# Altium schematic sheet K10P100最小系统V1.0.SchDoc
size A3
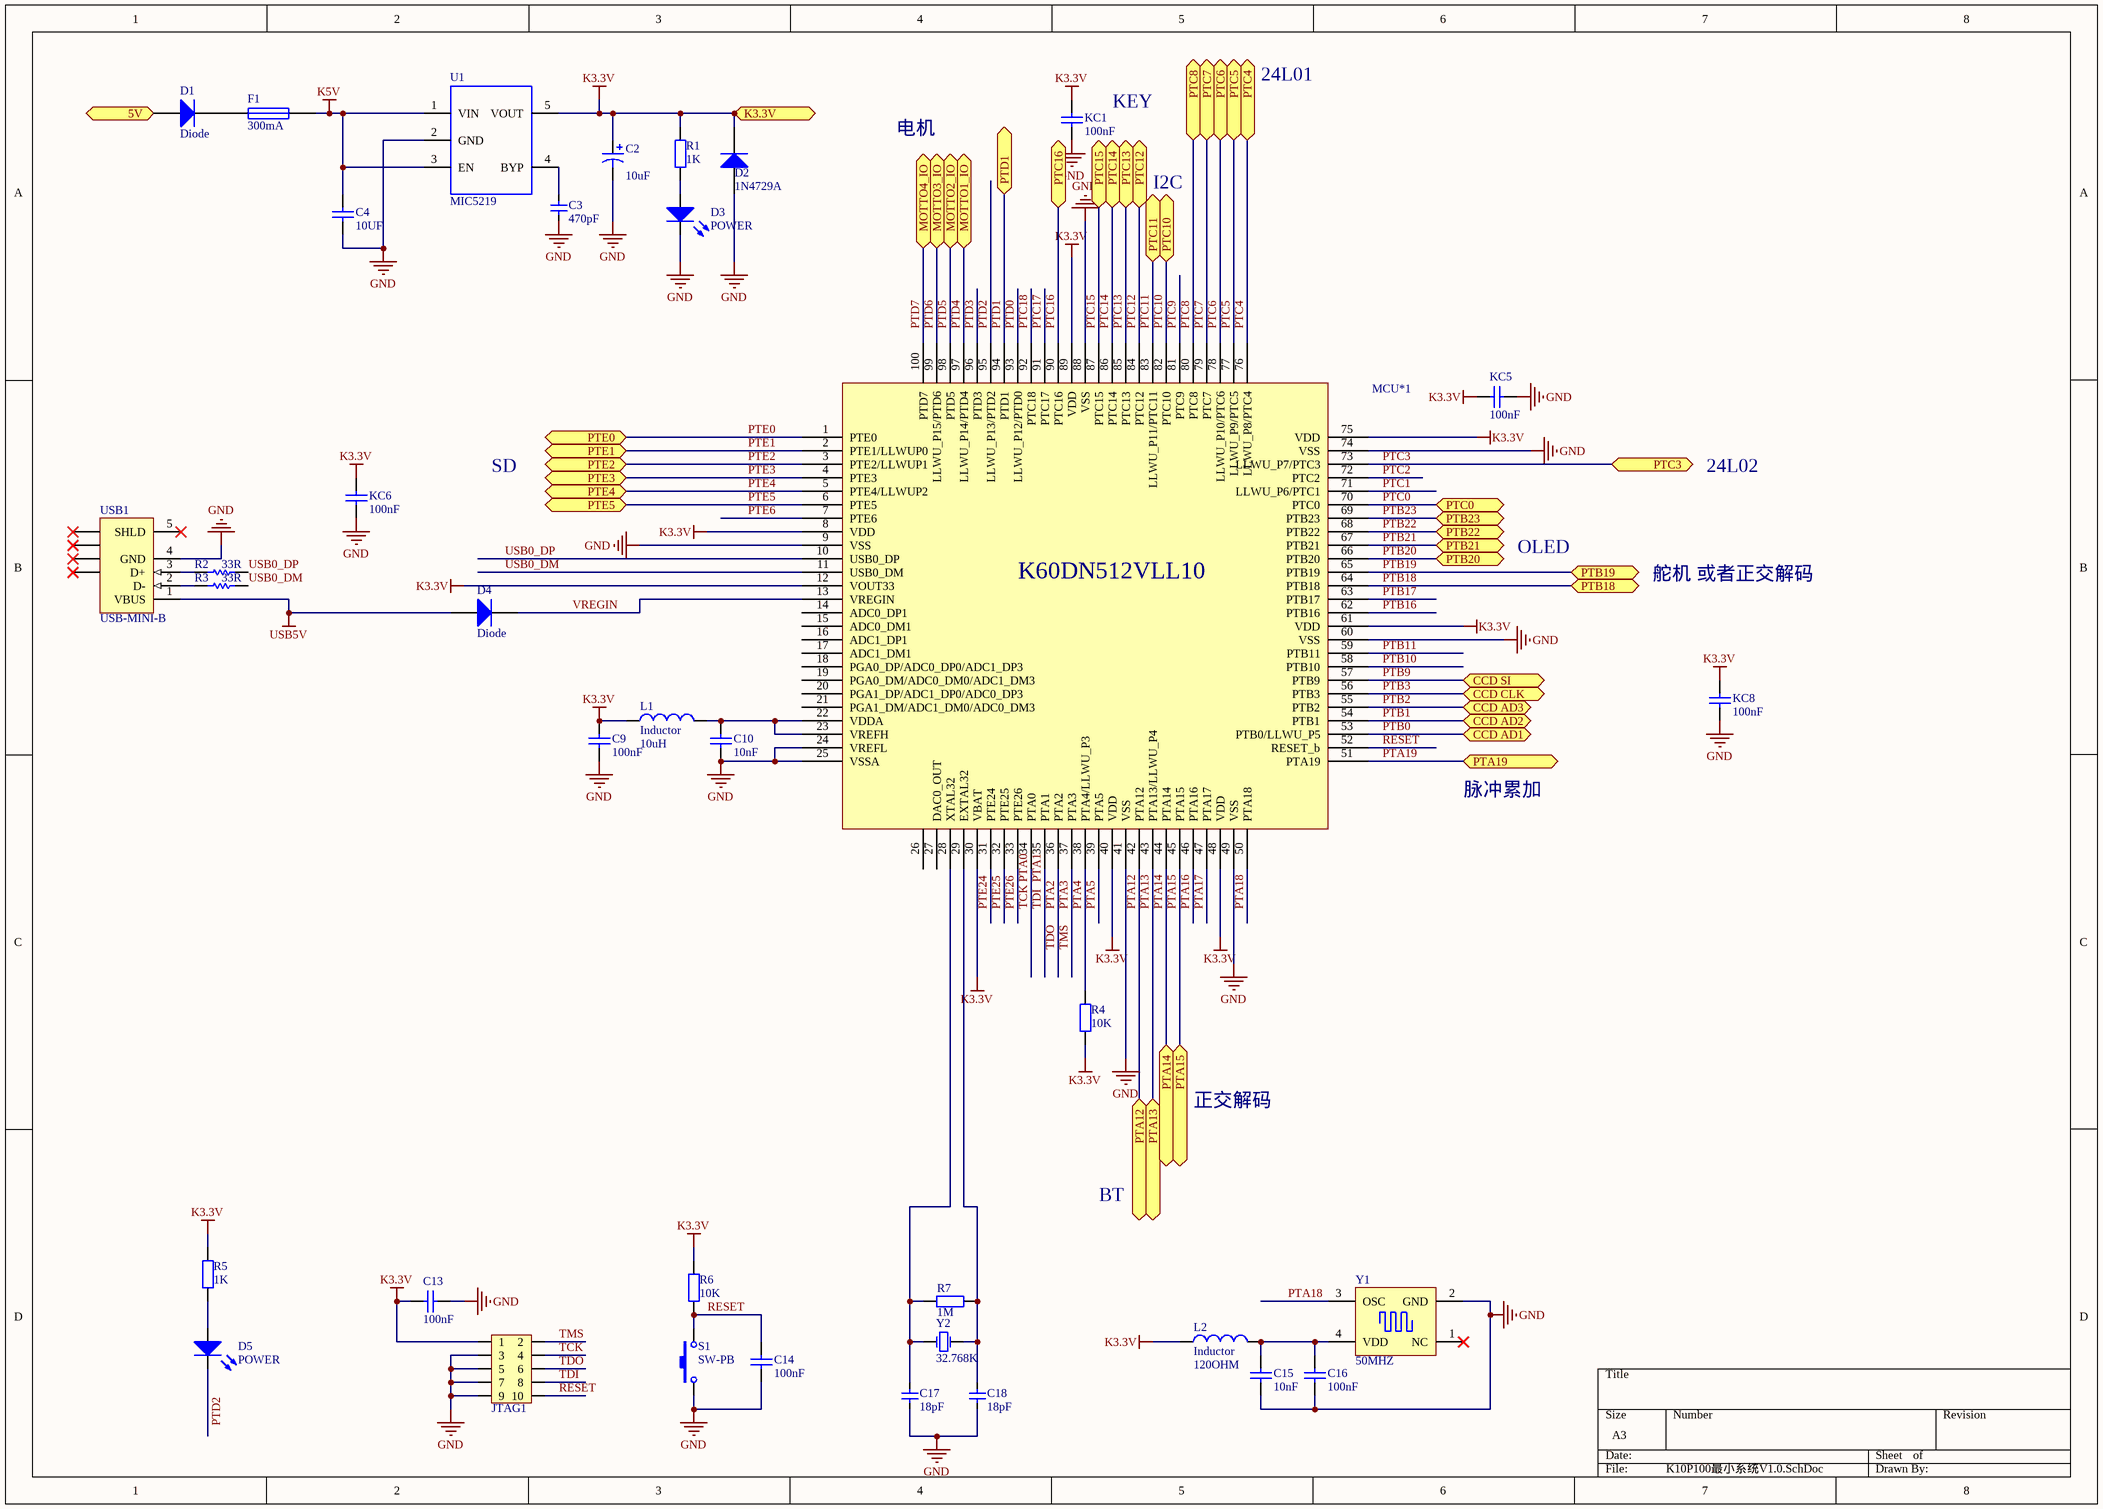
[diagram p0: K10P100最小系统V1.0.SchDoc]

## Parts
C2  value 10uF  [C2012]  (hidden comment: Cap Pol1)
C3  470pF  [C2012]
C4  10UF  [C2012]
C9  100nF  [C2012]
C10  10nF  [C2012]
C13  100nF  [C2012]
C14  100nF  [C2012]
C15  10nF  [C2012]
C16  100nF  [C2012]
C17  18pF  [C2012]
C18  18pF  [C2012]
D1  Diode  [1206(2)]
D2  1N4729A  [C2012]
D3  POWER  [C2012]
D4  Diode  [1206(2)]
D5  POWER  [C2012]
F1  300mA  [R2012]
JTAG1  Header 5X2  [IDC5X2]  (value not drawn)
KC1  100nF  [C2012]
KC5  100nF  [C2012]
KC6  100nF  [C2012]
KC8  100nF  [C2012]
L1  Inductor  value 10uH  [C2012]
L2  Inductor  value 120OHM  [C2012]
MCU*1  k60P100  [LQFP100]  (value not drawn)
R1  1K  [R2012]
R2  33R  [R2012]
R3  33R  [R2012]
R4  10K  [R2012]
R5  1K  [R2012]
R6  10K  [R2012]
R7  1M  [R2012]
S1  SW-PB  [sw 3*4 *2]
U1  MIC5219  [SOT-23-5]
USB1  USB-MINI-B  [USB-MINI-B]
Y1  50MHZ  [贴片有源晶体]
Y2  32.768K  [CT3215]

## Ports
5V, CCD AD1, CCD AD2, CCD AD3, CCD CLK, CCD SI, K3.3V, MOTTO1_IO, MOTTO2_IO, MOTTO3_IO, MOTTO4_IO, PTA12, PTA13, PTA14, PTA15, PTA19, PTB18, PTB19, PTB20, PTB21, PTB22, PTB23, PTC0, PTC3, PTC4, PTC5, PTC6, PTC7, PTC8, PTC10, PTC11, PTC12, PTC13, PTC14, PTC15, PTC16, PTD1, PTE0, PTE1, PTE2, PTE3, PTE4, PTE5

## Nets
GND: C2.2 C3.1 C4.1 C9.1 C10.1 C13.2 C14.1 C15.1 C16.1 C17.1 C18.1 D2.1(A) D3.2 JTAG1.3 JTAG1.5 JTAG1.7 JTAG1.9 KC1.1 KC5.1 KC6.1 KC8.1 MCU*1.9(VSS) MCU*1.24(VREFL) MCU*1.25(VSSA) MCU*1.41(VSS) MCU*1.49(VSS) MCU*1.60(VSS) MCU*1.74(VSS) MCU*1.88(VSS) S1.1 U1.2(GND) USB1.4(GND) Y1.2(GND)
K3.3V: C2.1 C9.2 C13.1 D2.2(K) JTAG1.1 KC1.2 KC5.2 KC6.2 KC8.2 L1.1 L2.1 MCU*1.8(VDD) MCU*1.12(VOUT33) MCU*1.30(VBAT) MCU*1.40(VDD) MCU*1.48(VDD) MCU*1.61(VDD) MCU*1.75(VDD) MCU*1.89(VDD) R1.2 R4.1 R5.2 R6.2 U1.5(VOUT) ; port K3.3V
K5V: C4.2 F1.1 U1.1(VIN) U1.3(EN)
USB5V: D4.1(A) USB1.1(VBUS)
5V: D1.1(A) ; port 5V
PTA0: JTAG1.4 MCU*1.34(PTA0)  [also labelled TCK]
PTA1: JTAG1.8 MCU*1.35(PTA1)  [also labelled TDI]
PTA2: JTAG1.6 MCU*1.36(PTA2)  [also labelled TDO]
PTA3: JTAG1.2 MCU*1.37(PTA3)  [also labelled TMS]
PTA4: MCU*1.38(PTA4/LLWU_P3) R4.2
PTA5: MCU*1.39(PTA5)
PTA12: MCU*1.42(PTA12) ; port PTA12
PTA13: MCU*1.43(PTA13/LLWU_P4) ; port PTA13
PTA14: MCU*1.44(PTA14) ; port PTA14
PTA15: MCU*1.45(PTA15) ; port PTA15
PTA16: MCU*1.46(PTA16)
PTA17: MCU*1.47(PTA17)
PTA18: MCU*1.50(PTA18) Y1.3(OSC)
PTA19: MCU*1.51(PTA19) ; port PTA19
PTB0: MCU*1.53(PTB0/LLWU_P5) ; port CCD AD1
PTB1: MCU*1.54(PTB1) ; port CCD AD2
PTB2: MCU*1.55(PTB2) ; port CCD AD3
PTB3: MCU*1.56(PTB3) ; port CCD CLK
PTB9: MCU*1.57(PTB9) ; port CCD SI
PTB10: MCU*1.58(PTB10)
PTB11: MCU*1.59(PTB11)
PTB16: MCU*1.62(PTB16)
PTB17: MCU*1.63(PTB17)
PTB18: MCU*1.64(PTB18) ; port PTB18
PTB19: MCU*1.65(PTB19) ; port PTB19
PTB20: MCU*1.66(PTB20) ; port PTB20
PTB21: MCU*1.67(PTB21) ; port PTB21
PTB22: MCU*1.68(PTB22) ; port PTB22
PTB23: MCU*1.69(PTB23) ; port PTB23
PTC0: MCU*1.70(PTC0) ; port PTC0
PTC1: MCU*1.71(LLWU_P6/PTC1)
PTC2: MCU*1.72(PTC2)
PTC3: MCU*1.73(LLWU_P7/PTC3) ; port PTC3
PTC4: MCU*1.76(LLWU_P8/PTC4) ; port PTC4
PTC5: MCU*1.77(LLWU_P9/PTC5) ; port PTC5
PTC6: MCU*1.78(LLWU_P10/PTC6) ; port PTC6
PTC7: MCU*1.79(PTC7) ; port PTC7
PTC8: MCU*1.80(PTC8) ; port PTC8
PTC9: MCU*1.81(PTC9)
PTC10: MCU*1.82(PTC10) ; port PTC10
PTC11: MCU*1.83(LLWU_P11/PTC11) ; port PTC11
PTC12: MCU*1.84(PTC12) ; port PTC12
PTC13: MCU*1.85(PTC13) ; port PTC13
PTC14: MCU*1.86(PTC14) ; port PTC14
PTC15: MCU*1.87(PTC15) ; port PTC15
PTC16: MCU*1.90(PTC16) ; port PTC16
PTC17: MCU*1.91(PTC17)
PTC18: MCU*1.92(PTC18)
PTD0: MCU*1.93(LLWU_P12/PTD0)
PTD1: MCU*1.94(PTD1) ; port PTD1
PTD2: D5.2 MCU*1.95(LLWU_P13/PTD2)
PTD3: MCU*1.96(PTD3)
PTD4: MCU*1.97(LLWU_P14/PTD4) ; port MOTTO1_IO
PTD5: MCU*1.98(PTD5) ; port MOTTO2_IO
PTD6: MCU*1.99(LLWU_P15/PTD6) ; port MOTTO3_IO
PTD7: MCU*1.100(PTD7) ; port MOTTO4_IO
PTE0: MCU*1.1(PTE0) ; port PTE0
PTE1: MCU*1.2(PTE1/LLWUP0) ; port PTE1
PTE2: MCU*1.3(PTE2/LLWUP1) ; port PTE2
PTE3: MCU*1.4(PTE3) ; port PTE3
PTE4: MCU*1.5(PTE4/LLWUP2) ; port PTE4
PTE5: MCU*1.6(PTE5) ; port PTE5
PTE6: MCU*1.7(PTE6)
PTE24: MCU*1.31(PTE24)
PTE25: MCU*1.32(PTE25)
PTE26: MCU*1.33(PTE26)
RESET: C14.2 JTAG1.10 MCU*1.52(RESET_b) R6.1 S1.2
USB0_DM: MCU*1.11(USB0_DM) R3.2
USB0_DP: MCU*1.10(USB0_DP) R2.2
VREGIN: D4.2(K) MCU*1.13(VREGIN)
NetC3_2: C3.2 U1.4(BYP)
NetC10_2: C10.2 L1.2 MCU*1.22(VDDA) MCU*1.23(VREFH)
NetC15_2: C15.2 C16.2 L2.2 Y1.4(VDD)
NetC17_2: C17.2 MCU*1.28(XTAL32) R7.1 Y2.1(OSC1)
NetC18_2: C18.2 MCU*1.29(EXTAL32) R7.2 Y2.2(OSC2)
NetD1_2: D1.2(K) F1.2
NetD3_1: D3.1 R1.1
NetD5_1: D5.1 R5.1
NetR2_1: R2.1 USB1.3(D+)
NetR3_1: R3.1 USB1.2(D-)

Not connected (* = marked no-connect by the designer): MCU*1 14(ADC0_DP1) 15(ADC0_DM1) 16(ADC1_DP1) 17(ADC1_DM1) 18(PGA0_DP/ADC0_DP0/ADC1_DP3) 19(PGA0_DM/ADC0_DM0/ADC1_DM3) 20(PGA1_DP/ADC1_DP0/ADC0_DP3) 21(PGA1_DM/ADC1_DM0/ADC0_DM3) 26(VREF_OUT/CMP1_IN5CMP0_IN5/ADC1_SE18) 27(DAC0_OUT); USB1 5(SHLD)* 6(SHLD)* 7(SHLD)* 8(SHLD)* 9(SHLD)*; Y1 1(NC)*

## Notes on the sheet
- (near KC1) KEY
- 24L01
- 电机
- I2C
- SD
- 24L02
- OLED
- 舵机 或者正交解码
- 脉冲累加
- 正交解码
- BT
- (in symbol k60P100) K60DN512VLL10

## Library data of the parts
C2 = Cap Pol1: Polarized Capacitor (Radial); Published: 8-Jun-2000; LatestRevisionDate: 17-Jul-2002; LatestRevisionNote: Re-released for DXP Platform.; PackageReference: RB7.6-15; Publisher: Altium Limited; PackageDescription: Polarized Capacitor (Radial); 2 Leads
C3 C17 C18 = 陶瓷电容: CAP
C4 C9 C10 C13-C16 KC1 KC5 KC6 KC8 = Cap: Capacitor
D1 D4 = Diode: Default Diode; Published: 8-Jun-2000; LatestRevisionDate: 17-Jul-2002; LatestRevisionNote: Re-released for DXP Platform.; PackageVersion: Sep-1996; PackageReference: SMC; Publisher: Altium Limited; PackageDescription: DO-214-AB/SMC; 2 C-Bend Leads; Body 7.9 x 5.9 mm, inc. leads (LxW); Code_JEDEC: DO-214-AB
D2 = Diode 1N4148: High Conductance Fast Diode; LatestRevisionDate: 17-Jul-2002; LatestRevisionNote: Re-released for DXP Platform.; DatasheetDocument: 1997; PackageReference: DO-35; Publisher: Altium Limited; Code_JEDEC: DO-204-AH; ComponentLink1Description: Manufacturer Link; ComponentLink2Description: Datasheet; ComponentLink2URL: http://www.fairchildsemi.com/ds/1N%2F1N4148.pdf
D3 D5 = LED: Typical INFRARED GaAs LED
F1 = Fuse 1: Fuse; Published: 8-Jun-2000; LatestRevisionDate: 17-Jul-2002; LatestRevisionNote: Re-released for DXP Platform.; PackageReference: PIN-W2/E2.8; Publisher: Altium Limited
JTAG1 = Header 5X2: Header, 5-Pin, Dual row
L1 L2 = Inductor: Code_IEC: 1005; Published: 8-Jun-2000; LatestRevisionDate: 29-May-2009; LatestRevisionNote: IPC-7351 Footprint Added.; PackageReference: 0402-A; Publisher: Altium Limited; PackageDescription: Chip Inductor; Code_JEITA: 0402
R1 R4 R5 = Res: Resistor of led
R2 R3 = Res: 贴片电阻; Value: 1K; Published: 8-Jun-2000; LatestRevisionDate: 17-Jul-2002; LatestRevisionNote: Re-released for DXP Platform.; PackageReference: AXIAL-0.3; Publisher: Altium Limited
R6 R7 = Res: Resistor
S1 = SW-PB: Switch
U1 = MIC5219: LDO
USB1 = USB-MINI-B: USB 2.0, Right Angle, SMT, A Type, Receptacle, 5 Position, Black; ContactMaterial: Phosphor Bronze; ContactPlating: Gold (30) over Nickel; PCB_Layout: Complies with manufacturer's recommendation.; DrillSize: Corresponds to nominal value.; PanelGround: Without; Published: 15-Jul-2004; DatasheetDocument: 15-Nov-2002; PackageDocument: 15-Nov-2002; PackageReference: 440478; Publisher: Altium Limited; HousingMaterial: Thermoplastic; ComponentLink1Description: Manufacturer Link; ComponentLink1URL: http://www.tycoelectronics.com/; ComponentLink2Description: Packaging Specification; ComponentLink2URL: http://ecommas.tycoelectronics.com/commerce/DocumentDelivery/DDEController?Action=showdoc&DocId=Customer+Drawing%7F440478%7FB%7Fpdf%7FEnglish%7FC_440478_B.pdf
Y1 = XTAL1
Y2 = XTAL: Crystal Oscillator